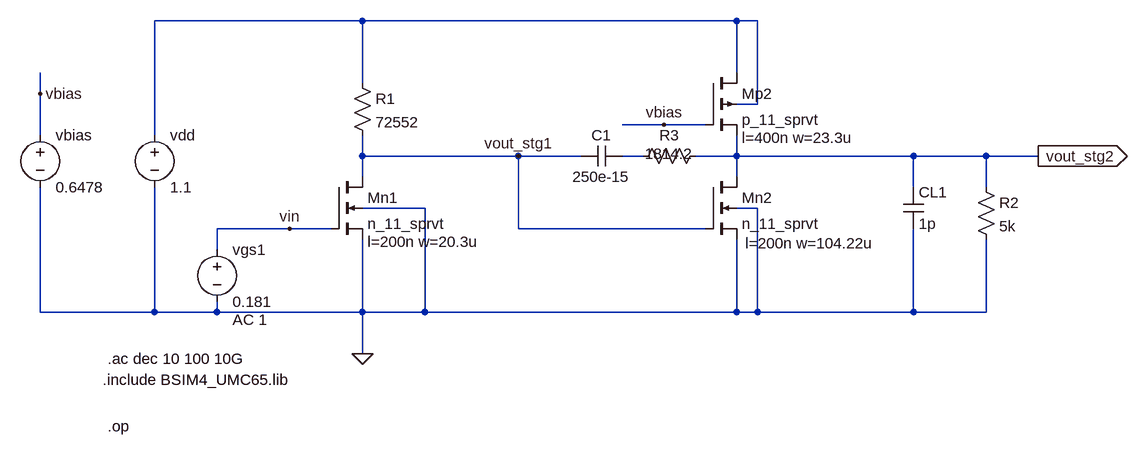
[diagram p0: schematic session_2.asc]
session_2.asc, the LTspice schematic file:
Version 4
SHEET 1 2368 756
WIRE 1152 -16 832 -16
WIRE 1728 -16 1152 -16
WIRE 1760 -16 1728 -16
WIRE 1728 64 1728 -16
WIRE 1152 80 1152 -16
WIRE 656 96 656 64
WIRE 1760 112 1760 -16
WIRE 1760 112 1728 112
WIRE 1616 144 1552 144
WIRE 1680 144 1616 144
WIRE 656 160 656 96
WIRE 832 160 832 -16
WIRE 1152 192 1152 160
WIRE 1392 192 1152 192
WIRE 1488 192 1392 192
WIRE 1584 192 1552 192
WIRE 1728 192 1728 160
WIRE 1728 192 1664 192
WIRE 2000 192 1728 192
WIRE 2112 192 2000 192
WIRE 2192 192 2112 192
WIRE 1152 224 1152 192
WIRE 1728 224 1728 192
WIRE 2000 240 2000 192
WIRE 2112 240 2112 192
WIRE 1248 272 1152 272
WIRE 1760 272 1728 272
WIRE 1040 304 928 304
WIRE 1104 304 1040 304
WIRE 1392 304 1392 192
WIRE 1680 304 1392 304
WIRE 928 336 928 304
WIRE 656 432 656 240
WIRE 832 432 832 240
WIRE 832 432 656 432
WIRE 928 432 928 416
WIRE 928 432 832 432
WIRE 1152 432 1152 320
WIRE 1152 432 928 432
WIRE 1248 432 1248 272
WIRE 1248 432 1152 432
WIRE 1728 432 1728 320
WIRE 1728 432 1248 432
WIRE 1760 432 1760 272
WIRE 1760 432 1728 432
WIRE 2000 432 2000 304
WIRE 2000 432 1760 432
WIRE 2112 432 2112 320
WIRE 2112 432 2000 432
WIRE 1152 496 1152 432
FLAG 1152 496 0
FLAG 1040 304 vin
FLAG 1616 144 vbias
FLAG 1392 192 vout_stg1
FLAG 2192 192 vout_stg2
IOPIN 2192 192 Out
FLAG 656 96 vbias
DATAFLAG 2032 192 ""
DATAFLAG 1328 192 ""
SYMBOL voltage 928 320 R0
WINDOW 123 24 124 Left 2
WINDOW 39 0 0 Left 0
SYMATTR Value2 AC 1
SYMATTR InstName vgs1
SYMATTR Value 0.181
SYMBOL voltage 832 144 R0
WINDOW 123 0 0 Left 0
WINDOW 39 0 0 Left 0
SYMATTR InstName vdd
SYMATTR Value 1.1
SYMBOL nmos4 1104 224 R0
WINDOW 123 56 100 Left 2
SYMATTR Value2 l=200n w=20.3u
SYMATTR InstName Mn1
SYMATTR Value n_11_sprvt
SYMBOL nmos4 1680 224 R0
WINDOW 123 61 102 Left 2
SYMATTR Value2 l=200n w=104.22u
SYMATTR InstName Mn2
SYMATTR Value n_11_sprvt
SYMBOL pmos4 1680 64 R0
WINDOW 123 56 100 Left 2
SYMATTR Value2 l=400n w=23.3u
SYMATTR InstName Mp2
SYMATTR Value p_11_sprvt
SYMBOL cap 1984 240 R0
SYMATTR InstName CL1
SYMATTR Value 1p
SYMBOL voltage 656 144 R0
WINDOW 123 0 0 Left 0
WINDOW 39 0 0 Left 0
SYMATTR InstName vbias
SYMATTR Value 0.6478
SYMBOL res 1136 64 R0
SYMATTR InstName R1
SYMATTR Value 72552
SYMBOL res 2096 224 R0
SYMATTR InstName R2
SYMATTR Value 5k
SYMBOL cap 1552 176 R90
WINDOW 0 0 32 VBottom 2
WINDOW 3 32 32 VTop 2
SYMATTR InstName C1
SYMATTR Value 250e-15
SYMBOL res 1680 176 R90
WINDOW 0 0 56 VBottom 2
WINDOW 3 28 56 VBottom 2
SYMATTR InstName R3
SYMATTR Value 1814.2
TEXT 752 536 Left 2 !.include BSIM4_UMC65.lib
TEXT 760 504 Left 2 !.ac dec 10 100 10G
TEXT 760 608 Left 2 !.op

The netlist it stands for:
* session_2.asc
vgs1 vin 0 0.181 AC 1
vdd N001 0 1.1
Mn1 vout_stg1 vin 0 0 n_11_sprvt l=200n w=20.3u
Mn2 vout_stg2 vout_stg1 0 0 n_11_sprvt l=200n w=104.22u
Mp2 N001 vbias vout_stg2 N001 p_11_sprvt l=400n w=23.3u
CL1 vout_stg2 0 1p
vbias vbias 0 0.6478
R1 N001 vout_stg1 72552
R2 vout_stg2 0 5k
C1 N002 vout_stg1 250e-15
R3 vout_stg2 N002 1814.2
.model NMOS NMOS
.model PMOS PMOS
.lib standard.mos
.include BSIM4_UMC65.lib
.ac dec 10 100 10G
.op
.backanno
.end